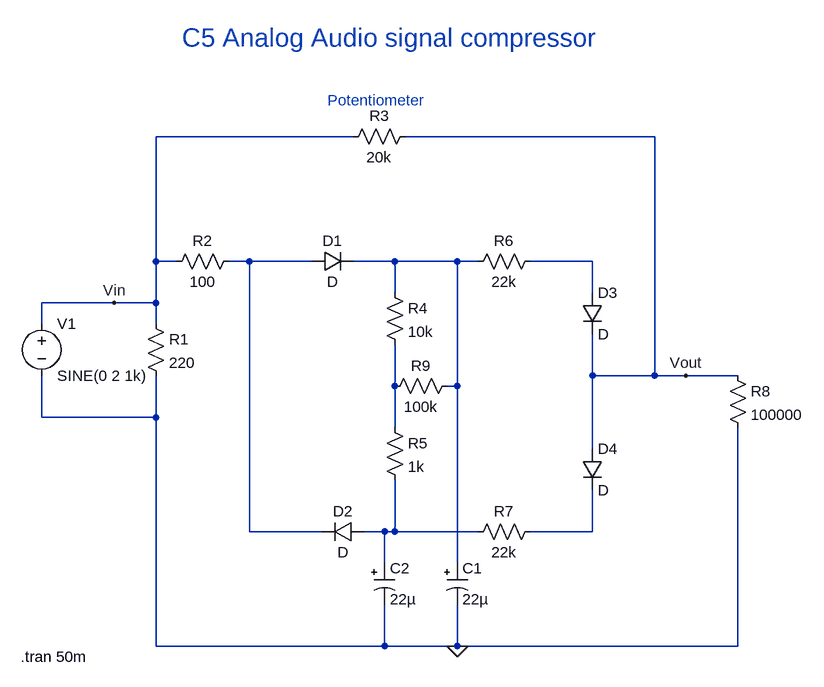
[diagram p0: schematic Audio signal compressor .asc]
Audio signal compressor .asc, the LTspice schematic file:
Version 4
SHEET 1 1200 680
WIRE 496 -160 192 -160
WIRE 960 -160 576 -160
WIRE 192 32 192 -160
WIRE 224 32 192 32
WIRE 336 32 304 32
WIRE 432 32 336 32
WIRE 560 32 496 32
WIRE 656 32 560 32
WIRE 688 32 656 32
WIRE 864 32 768 32
WIRE 560 80 560 32
WIRE 864 80 864 32
WIRE 128 96 16 96
WIRE 192 96 192 32
WIRE 192 96 128 96
WIRE 16 128 16 96
WIRE 192 128 192 96
WIRE 864 208 864 144
WIRE 960 208 960 -160
WIRE 960 208 864 208
WIRE 1008 208 960 208
WIRE 1088 208 1008 208
WIRE 560 224 560 160
WIRE 656 224 656 32
WIRE 656 224 640 224
WIRE 16 272 16 208
WIRE 192 272 192 208
WIRE 192 272 16 272
WIRE 560 288 560 224
WIRE 864 320 864 208
WIRE 336 448 336 32
WIRE 448 448 336 448
WIRE 544 448 512 448
WIRE 560 448 560 368
WIRE 560 448 544 448
WIRE 688 448 560 448
WIRE 864 448 864 384
WIRE 864 448 768 448
WIRE 544 496 544 448
WIRE 656 496 656 224
WIRE 192 624 192 272
WIRE 544 624 544 560
WIRE 544 624 192 624
WIRE 656 624 656 560
WIRE 656 624 544 624
WIRE 1088 624 1088 288
WIRE 1088 624 656 624
FLAG 656 624 0
FLAG 1008 208 Vout
FLAG 128 96 Vin
SYMBOL voltage 16 112 R0
WINDOW 123 0 0 Left 0
WINDOW 39 0 0 Left 0
SYMATTR InstName V1
SYMATTR Value SINE(0 2 1k)
SYMBOL res 176 112 R0
SYMATTR InstName R1
SYMATTR Value 220
SYMBOL res 320 16 R90
WINDOW 0 0 56 VBottom 2
WINDOW 3 32 56 VTop 2
SYMATTR InstName R2
SYMATTR Value 100
SYMBOL res 592 -176 R90
WINDOW 0 0 56 VBottom 2
WINDOW 3 32 56 VTop 2
SYMATTR InstName R3
SYMATTR Value 20k
SYMBOL diode 432 48 R270
WINDOW 0 32 32 VTop 2
WINDOW 3 0 32 VBottom 2
SYMATTR InstName D1
SYMBOL diode 512 432 R90
WINDOW 0 0 32 VBottom 2
WINDOW 3 32 32 VTop 2
SYMATTR InstName D2
SYMBOL res 544 64 R0
SYMATTR InstName R4
SYMATTR Value 10k
SYMBOL res 544 272 R0
SYMATTR InstName R5
SYMATTR Value 1k
SYMBOL res 672 48 R270
WINDOW 0 32 56 VTop 2
WINDOW 3 0 56 VBottom 2
SYMATTR InstName R6
SYMATTR Value 22k
SYMBOL res 672 464 R270
WINDOW 0 32 56 VTop 2
WINDOW 3 0 56 VBottom 2
SYMATTR InstName R7
SYMATTR Value 22k
SYMBOL diode 848 320 R0
SYMATTR InstName D4
SYMBOL diode 848 80 R0
SYMATTR InstName D3
SYMBOL res 1072 192 R0
SYMATTR InstName R8
SYMATTR Value 100000
SYMBOL res 656 208 R90
WINDOW 0 0 56 VBottom 2
WINDOW 3 32 56 VTop 2
SYMATTR InstName R9
SYMATTR Value 100k
SYMBOL polcap 640 496 R0
SYMATTR InstName C1
SYMATTR Value 22µ
SYMBOL polcap 528 496 R0
SYMATTR InstName C2
SYMATTR Value 22µ
TEXT -16 640 Left 2 !.tran 50m
TEXT 456 -216 Left 2 ;Potentiometer
TEXT 232 -312 Left 4 ;C5 Analog Audio signal compressor

The netlist it stands for:
* Audio signal compressor .asc
V1 Vin 0 SINE(0 2 1k)
R1 Vin 0 220
R2 N001 Vin 100
R3 Vout Vin 20k
D1 N001 N002 D
D2 N005 N001 D
R4 N002 N004 10k
R5 N004 N005 1k
R6 N002 N003 22k
R7 N005 N006 22k
D4 Vout N006 D
D3 N003 Vout D
R8 Vout 0 100000
R9 N002 N004 100k
C1 N002 0 22µ
C2 N005 0 22µ
.model D D
.lib standard.dio
.tran 50m
* Potentiometer
* C5 Analog Audio signal compressor
.backanno
.end